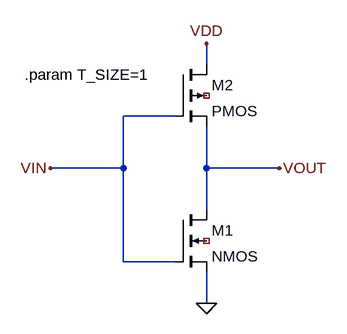
[diagram p0: schematic invertor.asc]
invertor.asc, the LTspice schematic file:
Version 4
SHEET 1 880 680
WIRE 336 -32 336 -64
WIRE 288 48 208 48
WIRE 208 128 208 48
WIRE 208 128 96 128
WIRE 336 128 336 64
WIRE 448 128 336 128
WIRE 336 192 336 128
WIRE 208 272 208 128
WIRE 288 272 208 272
WIRE 336 336 336 288
FLAG 96 128 VIN
FLAG 448 128 VOUT
FLAG 336 -64 VDD
FLAG 336 336 0
SYMBOL pmos4 288 -32 R0
SYMATTR InstName M2
SYMATTR Value2 l=90n w='(T_SIZE)*400n'
SYMBOL nmos4 288 192 R0
SYMATTR InstName M1
SYMATTR Value2 l=90n w='(T_SIZE)*200n'
TEXT 56 -16 Left 2 !.param T_SIZE=1

The netlist it stands for:
* invertor.asc
M2 VDD VIN VOUT NC_01 PMOS l=90n w='(T_SIZE)*400n'
M1 VOUT VIN 0 NC_02 NMOS l=90n w='(T_SIZE)*200n'
.model NMOS NMOS
.model PMOS PMOS
.lib standard.mos
.param T_SIZE=1
.backanno
.end